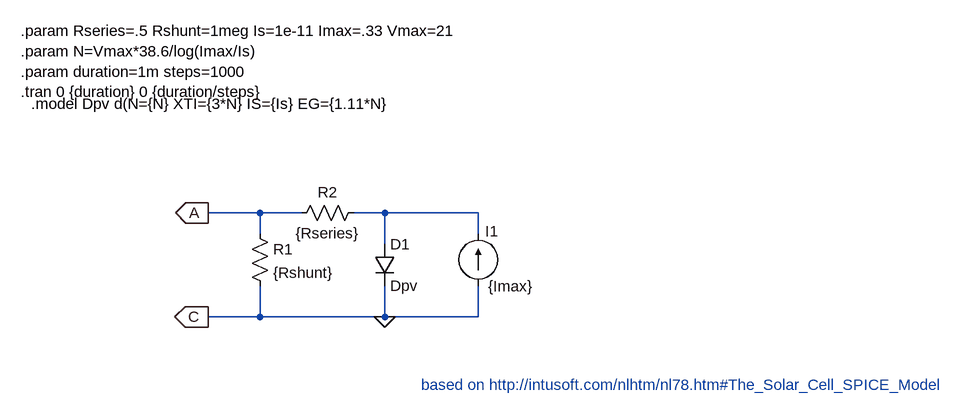
[diagram p0: schematic solarcell.asc]
solarcell.asc, the LTspice schematic file:
Version 4
SHEET 1 1336 680
WIRE 48 320 -32 320
WIRE 112 320 48 320
WIRE 240 320 192 320
WIRE 384 320 240 320
WIRE 48 352 48 320
WIRE 384 352 384 320
WIRE 240 368 240 320
WIRE 48 480 48 432
WIRE 48 480 -32 480
WIRE 240 480 240 432
WIRE 240 480 48 480
WIRE 384 480 384 432
WIRE 384 480 240 480
FLAG 240 480 0
FLAG -32 320 A
IOPIN -32 320 Out
FLAG -32 480 C
IOPIN -32 480 Out
SYMBOL Res 32 336 R0
SYMATTR InstName R1
SYMATTR Value {Rshunt}
SYMBOL Res 208 304 R90
WINDOW 0 0 56 VBottom 2
WINDOW 3 32 56 VTop 2
SYMATTR InstName R2
SYMATTR Value {Rseries}
SYMBOL Diode 224 368 R0
SYMATTR InstName D1
SYMATTR Value Dpv
SYMBOL current 384 432 R180
WINDOW 0 -31 84 Left 2
WINDOW 3 -84 -1 Left 2
SYMATTR InstName I1
SYMATTR Value {Imax}
TEXT -320 40 Left 2 !.param Rseries=.5 Rshunt=1meg Is=1e-11 Imax=.33 Vmax=21\n.param N=Vmax*38.6/log(Imax/Is)\n.param duration=1m steps=1000\n.tran 0 {duration} 0 {duration/steps}
TEXT -304 152 Left 2 !.model Dpv d(N={N} XTI={3*N} IS={Is} EG={1.11*N}
TEXT 296 584 Left 2 ;based on http://intusoft.com/nlhtm/nl78.htm#The_Solar_Cell_SPICE_Model

The netlist it stands for:
* solarcell.asc
R1 A 0 {Rshunt}
R2 N001 A {Rseries}
D1 N001 0 Dpv
I1 0 N001 {Imax}
.model D D
.lib standard.dio
.param Rseries=.5 Rshunt=1meg Is=1e-11 Imax=.33 Vmax=21
.param N=Vmax*38.6/log(Imax/Is)
.param duration=1m steps=1000
.tran 0 {duration} 0 {duration/steps}
.model Dpv d(N={N} XTI={3*N} IS={Is} EG={1.11*N}
* based on http://intusoft.com/nlhtm/nl78.htm#The_Solar_Cell_SPICE_Model
.backanno
.end